# Altium schematic sheet Sheet1.SchDoc
size A3
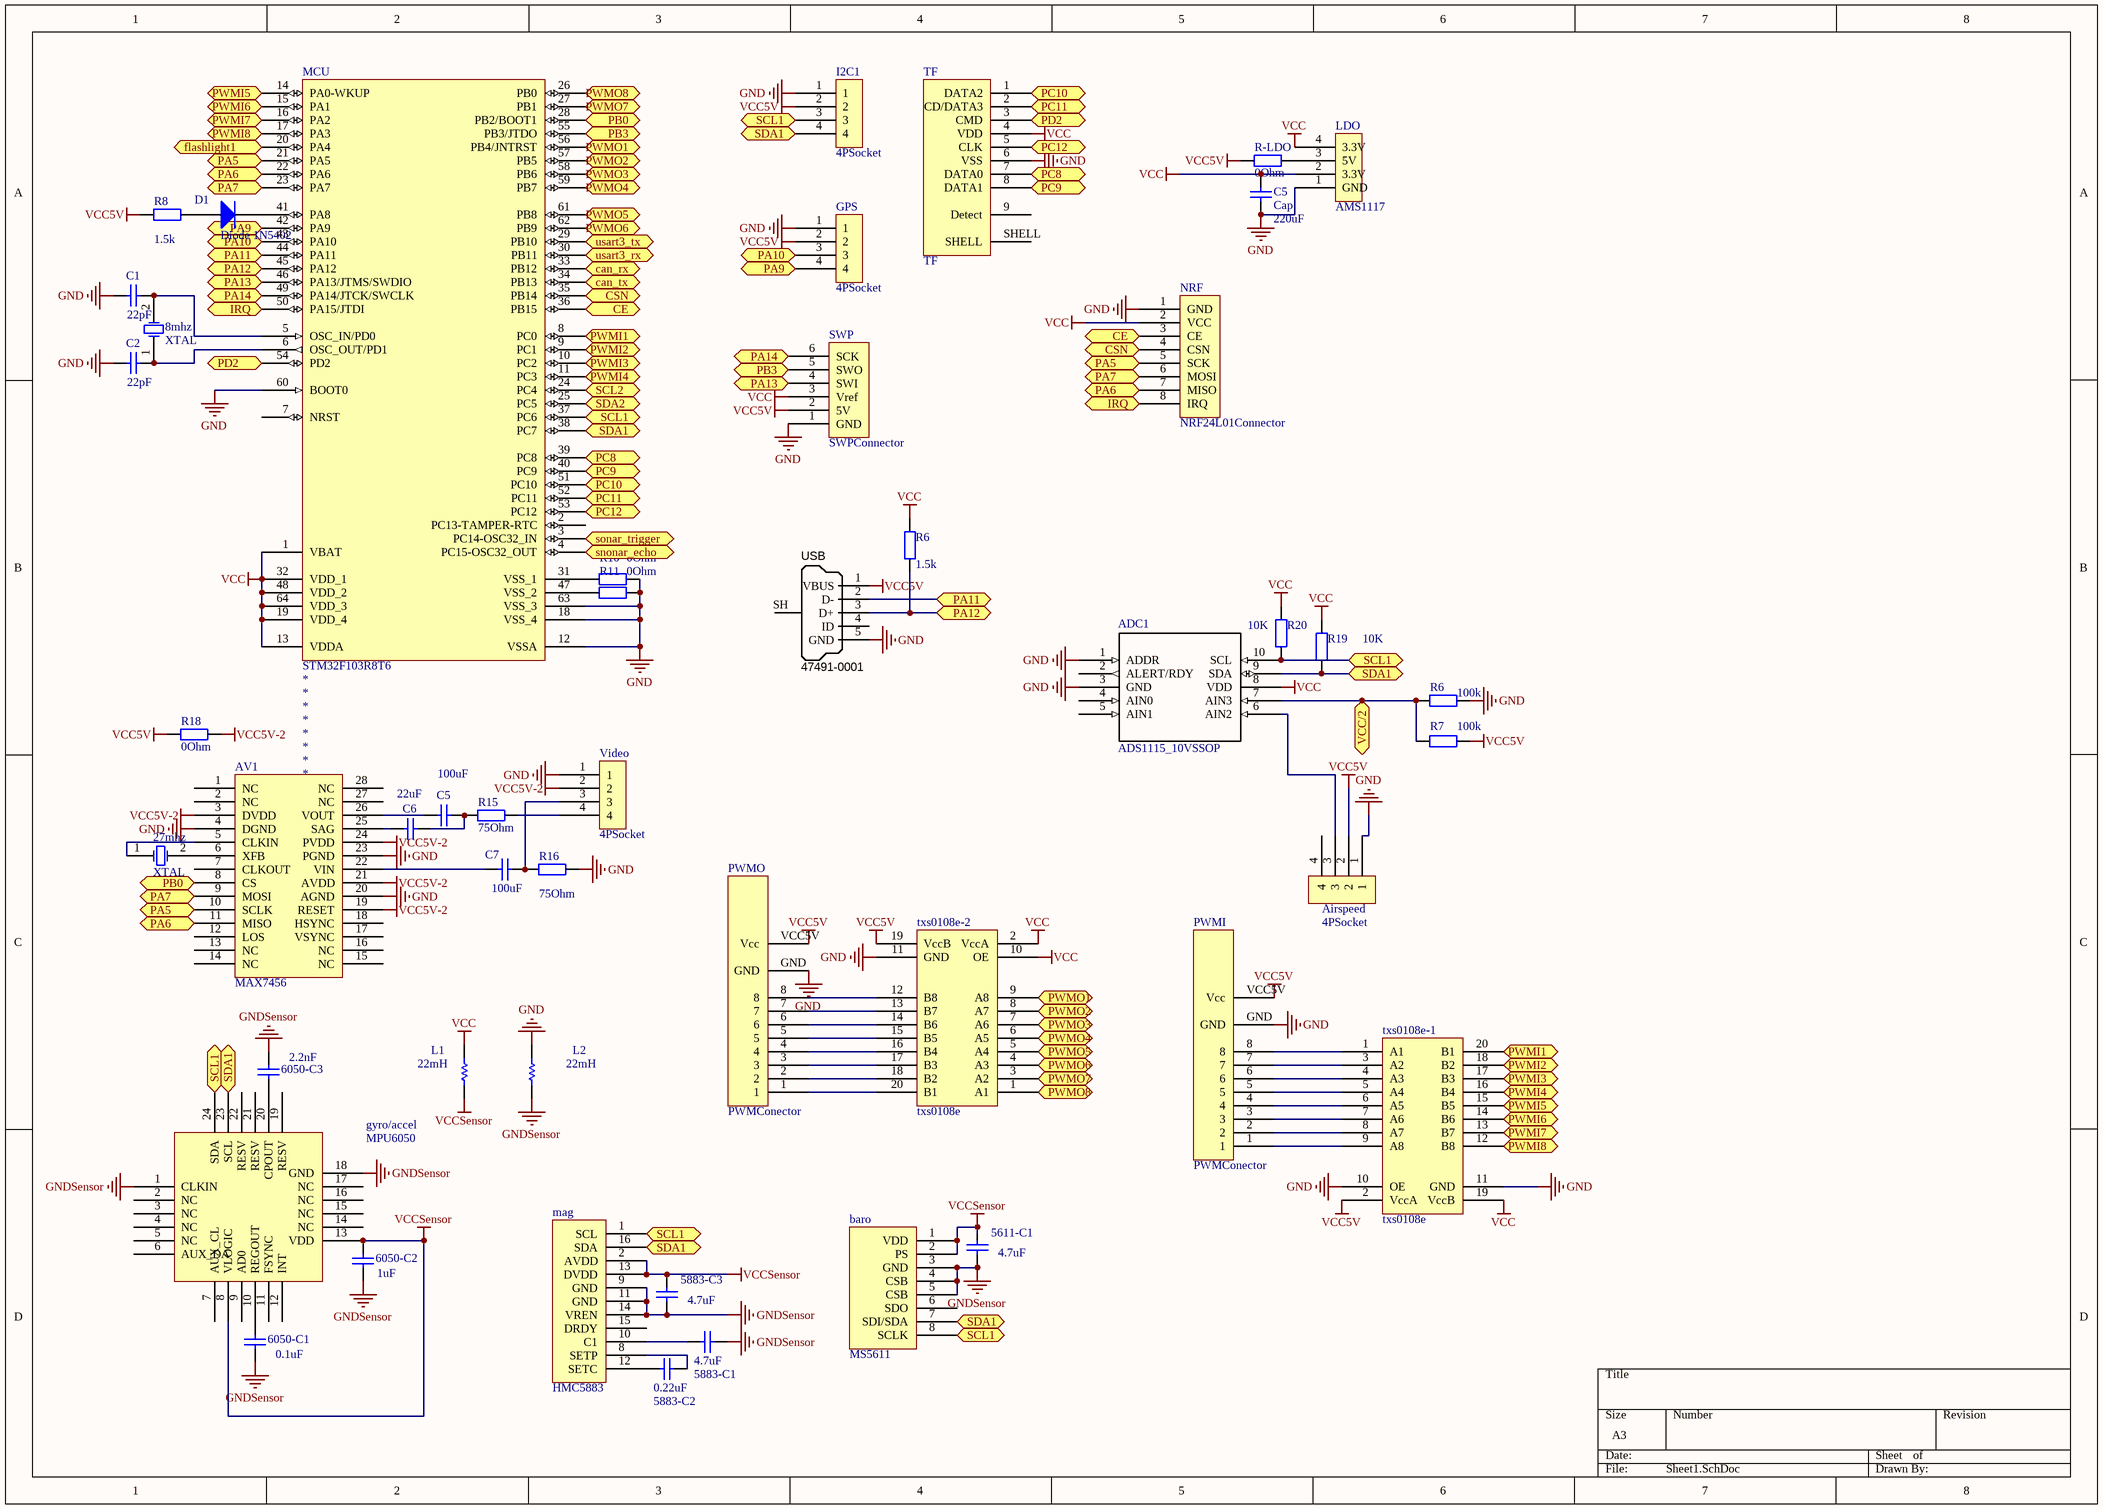
[diagram p0: Sheet1.SchDoc]

## Parts
(Parts that share a designator on the sheet are numbered #1, #2 ... from top to bottom, then left to right.)
8mhz  XTAL  [5032]
27mhz  XTAL  [5032]
5611-C1  value 4.7uF  [0603]
5883-C1  value 4.7uF  [0603]
5883-C2  value 0.22uF  [0603]
5883-C3  value 4.7uF  [0603]
6050-C1  value 0.1uF  [0603]
6050-C2  value 1uF  [0603]
6050-C3  value 2.2nF  [0603]
ADC1  ADS1115_10VSSOP  [10VSSOP]
Airspeed  4PSocket  [4P_SMT]
AV1  MAX7456  [28TSSOP - no pad]
baro  MS5611  [MS5611]
C1  value 22pF  [0603]
C2  value 22pF  [0603]
C5#1  Cap  value 220uF  [1210]
C5#2  value 100uF  [1210]
C6  value 22uF  [1210]
C7  value 100uF  [0603]
D1  Diode 1N5402  [0603]
GPS  4PSocket  [4P_SMT]
gyro/accel  MPU6050  [MPU6050]
I2C1  4PSocket  [4P_SMT]
L1  value 22mH  [0603]
L2  value 22mH  [0603]
LDO  AMS1117  [SOT-223]
mag  HMC5883  [HMC5883]
MCU  STM32F103R8T6  [LQFP64_N]
NRF  NRF24L01Connector  [NRF24L01Pad - SMT]
PWMI  PWMConector  [PWMConnector]
PWMO  PWMConector  [PWMConnector]
R6#1  value 1.5k  [0603]
R6#2  value 100k  [0603]
R7  value 100k  [0603]
R8  value 1.5k  [0603]
R10  value 0Ohm  [0603]
R11  value 0Ohm  [0603]
R15  value 75Ohm  [0603]
R16  value 75Ohm  [0603]
R18  value 0Ohm  [0603]
R19  value 10K  [0603]
R20  value 10K  [0603]
R-LDO  value 0Ohm  [0603]
SWP  SWPConnector  [SWPConnector - SMT]
TF  TF  [TF]
txs0108e-1  txs0108e  [TSSOP20]
txs0108e-2  txs0108e  [TSSOP20]
USB  Manufacturer Part Number 1: 47491-0001  [USB]  (hidden comment: USB Micro Type B)
Video  4PSocket  [4P_SMT]

## Ports
can_rx, can_tx, CE, CSN, flashlight1, IRQ, PA5, PA6, PA7, PA9, PA10, PA11, PA12, PA13, PA14, PB0, PB3, PC8, PC9, PC10, PC11, PC12, PD2, PWMI1, PWMI2, PWMI3, PWMI4, PWMI5, PWMI6, PWMI7, PWMI8, PWMO1, PWMO2, PWMO3, PWMO4, PWMO5, PWMO6, PWMO7, PWMO8, SCL1, SCL2, SDA1, SDA2, snonar_echo, sonar_trigger, usart3_rx, usart3_tx, VCC/2

## Nets
GND: ADC1.1(ADDR) ADC1.3(GND) Airspeed.1 AV1.4(DGND) AV1.20(AGND) AV1.23(PGND) C1.1 C2.1 C5#1.1 GPS.1 I2C1.1 L2.2 LDO.1(GND) MCU.12(VSSA) MCU.18(VSS_4) MCU.60(BOOT0) MCU.63(VSS_3) NRF.1(GND) PWMI.GND PWMO.GND R6#2.1 R10.2 R11.2 R16.1 SWP.1(GND) TF.6(VSS) txs0108e-1.10(OE) txs0108e-1.11(GND) txs0108e-2.11(GND) USB.5(GND) Video.1
GNDSensor: 5611-C1.1 5883-C1.2 5883-C3.1 6050-C1.1 6050-C2.1 6050-C3.2 baro.3(GND) baro.4(CSB) baro.5(CSB) gyro/accel.1(CLKIN) gyro/accel.18(GND) L2.1 mag.9(GND) mag.11(GND) mag.14(VREN)
VCC: ADC1.8(VDD) C5#1.2 L1.2 LDO.2(3.3V) LDO.4(3.3V) MCU.1(VBAT) MCU.13(VDDA) MCU.19(VDD_4) MCU.32(VDD_1) MCU.48(VDD_2) MCU.64(VDD_3) NRF.2(VCC) R6#1.2 R19.1 R20.1 SWP.3(Vref) TF.4(VDD) txs0108e-1.19(VccB) txs0108e-2.2(VccA) txs0108e-2.10(OE)
VCC5V: Airspeed.2 GPS.2 I2C1.2 PWMI.VCC5V(Vcc) PWMO.VCC5V(Vcc) R7.2 R8.1 R18.1 R-LDO.1 SWP.2(5V) txs0108e-1.2(VccA) txs0108e-2.19(VccB) USB.1(VBUS)
VCC5V-2: AV1.3(DVDD) AV1.19(RESET) AV1.21(AVDD) AV1.24(PVDD) R18.2 Video.2
VCCSensor: 5611-C1.2 5883-C3.2 6050-C2.2 baro.1(VDD) baro.2(PS) gyro/accel.8(VLOGIC) gyro/accel.13(VDD) L1.1 mag.2(AVDD) mag.13(DVDD)
can_rx: MCU.33(PB12) ; port can_rx
can_tx: MCU.34(PB13) ; port can_tx
CE: MCU.36(PB15) NRF.3(CE) ; port CE
CSN: MCU.35(PB14) NRF.4(CSN) ; port CSN
flashlight1: MCU.20(PA4) ; port flashlight1
IRQ: MCU.50(PA15/JTDI) NRF.8(IRQ) ; port IRQ
PA5: AV1.10(SCLK) MCU.21(PA5) NRF.5(SCK) ; port PA5
PA6: AV1.11(MISO) MCU.22(PA6) NRF.7(MISO) ; port PA6
PA7: AV1.9(MOSI) MCU.23(PA7) NRF.6(MOSI) ; port PA7
PA9: GPS.4 MCU.42(PA9) ; port PA9
PA10: GPS.3 MCU.43(PA10) ; port PA10
PA11: MCU.44(PA11) USB.2(D-) ; port PA11
PA12: MCU.45(PA12) R6#1.1 USB.3(D+) ; port PA12
PA13: MCU.46(PA13/JTMS/SWDIO) SWP.4(SWI) ; port PA13
PA14: MCU.49(PA14/JTCK/SWCLK) SWP.6(SCK) ; port PA14
PB0: AV1.8(CS) MCU.28(PB2/BOOT1) ; port PB0
PB3: MCU.55(PB3/JTDO) SWP.5(SWO) ; port PB3
PC8: MCU.39(PC8) TF.7(DATA0) ; port PC8
PC9: MCU.40(PC9) TF.8(DATA1) ; port PC9
PC10: MCU.51(PC10) TF.1(DATA2) ; port PC10
PC11: MCU.52(PC11) TF.2(CD/DATA3) ; port PC11
PC12: MCU.53(PC12) TF.5(CLK) ; port PC12
PD2: MCU.54(PD2) TF.3(CMD) ; port PD2
PWMI1: MCU.8(PC0) txs0108e-1.20(B1) ; port PWMI1
PWMI2: MCU.9(PC1) txs0108e-1.18(B2) ; port PWMI2
PWMI3: MCU.10(PC2) txs0108e-1.17(B3) ; port PWMI3
PWMI4: MCU.11(PC3) txs0108e-1.16(B4) ; port PWMI4
PWMI5: MCU.14(PA0-WKUP) txs0108e-1.15(B5) ; port PWMI5
PWMI6: MCU.15(PA1) txs0108e-1.14(B6) ; port PWMI6
PWMI7: MCU.16(PA2) txs0108e-1.13(B7) ; port PWMI7
PWMI8: MCU.17(PA3) txs0108e-1.12(B8) ; port PWMI8
PWMO1: MCU.56(PB4/JNTRST) txs0108e-2.9(A8) ; port PWMO1
PWMO2: MCU.57(PB5) txs0108e-2.8(A7) ; port PWMO2
PWMO3: MCU.58(PB6) txs0108e-2.7(A6) ; port PWMO3
PWMO4: MCU.59(PB7) txs0108e-2.6(A5) ; port PWMO4
PWMO5: MCU.61(PB8) txs0108e-2.5(A4) ; port PWMO5
PWMO6: MCU.62(PB9) txs0108e-2.4(A3) ; port PWMO6
PWMO7: MCU.27(PB1) txs0108e-2.3(A2) ; port PWMO7
PWMO8: MCU.26(PB0) txs0108e-2.1(A1) ; port PWMO8
SCL1: ADC1.10(SCL) baro.8(SCLK) gyro/accel.24(SDA) I2C1.3 mag.1(SCL) MCU.37(PC6) R20.2 ; port SCL1
SCL2: MCU.24(PC4) ; port SCL2
SDA1: ADC1.9(SDA) baro.7(SDI/SDA) gyro/accel.23(SCL) I2C1.4 mag.16(SDA) MCU.38(PC7) R19.2 ; port SDA1
SDA2: MCU.25(PC5) ; port SDA2
snonar_echo: MCU.4(PC15-OSC32_OUT) ; port snonar_echo
sonar_trigger: MCU.3(PC14-OSC32_IN) ; port sonar_trigger
usart3_rx: MCU.30(PB11) ; port usart3_rx
usart3_tx: MCU.29(PB10) ; port usart3_tx
VCC/2: ADC1.7(AIN3) R6#2.2 R7.1 ; port VCC/2
Net8mhz_1: 8mhz.1(OSC1) C2.2 MCU.6(OSC_OUT/PD1)
Net8mhz_2: 8mhz.2(OSC2) C1.2 MCU.5(OSC_IN/PD0)
Net27mhz_1: 27mhz.1(OSC1) AV1.5(CLKIN)
Net27mhz_2: 27mhz.2(OSC2) AV1.6(XFB)
Net5883-C1_1: 5883-C1.1 mag.10(C1)
Net5883-C2_1: 5883-C2.1 mag.12(SETC)
Net5883-C2_2: 5883-C2.2 mag.8(SETP)
Net6050-C1_2: 6050-C1.2 gyro/accel.10(REGOUT)
Net6050-C3_1: 6050-C3.1 gyro/accel.20(CPOUT)
NetADC1_6: ADC1.6(AIN2) Airspeed.3
NetAV1_22: AV1.22(VIN) C7.1
NetAV1_25: AV1.25(SAG) C6.1
NetAV1_26: AV1.26(VOUT) C5#2.1
NetC5#2_2: C5#2.2 C6.2 R15.1
NetC7_2: C7.2 R16.2 Video.3
NetD1_1: D1.1(A) R8.2
NetD1_2: D1.2(K) MCU.41(PA8)
NetLDO_3: LDO.3(5V) R-LDO.2
NetMCU_31: MCU.31(VSS_1) R10.1
NetMCU_47: MCU.47(VSS_2) R11.1
NetPWMI_1: PWMI.1 txs0108e-1.9(A8)
NetPWMI_2: PWMI.2 txs0108e-1.8(A7)
NetPWMI_3: PWMI.3 txs0108e-1.7(A6)
NetPWMI_4: PWMI.4 txs0108e-1.6(A5)
NetPWMI_5: PWMI.5 txs0108e-1.5(A4)
NetPWMI_6: PWMI.6 txs0108e-1.4(A3)
NetPWMI_7: PWMI.7 txs0108e-1.3(A2)
NetPWMI_8: PWMI.8 txs0108e-1.1(A1)
NetPWMO_1: PWMO.1 txs0108e-2.20(B1)
NetPWMO_2: PWMO.2 txs0108e-2.18(B2)
NetPWMO_3: PWMO.3 txs0108e-2.17(B3)
NetPWMO_4: PWMO.4 txs0108e-2.16(B4)
NetPWMO_5: PWMO.5 txs0108e-2.15(B5)
NetPWMO_6: PWMO.6 txs0108e-2.14(B6)
NetPWMO_7: PWMO.7 txs0108e-2.13(B7)
NetPWMO_8: PWMO.8 txs0108e-2.12(B8)
NetR15_2: R15.2 Video.4

Not connected (* = marked no-connect by the designer): ADC1 2(ALERT/RDY) 4(AIN0) 5(AIN1); Airspeed 4; AV1 1(NC) 2(NC) 7(CLKOUT) 12(LOS) 13(NC) 14(NC) 15(NC) 16(NC) 17(VSYNC) 18(HSYNC) 27(NC) 28(NC); baro 6(SDO); gyro/accel 2(NC) 3(NC) 4(NC) 5(NC) 6(AUX_DA) 7(AUX_CL) 9(AD0) 11(FSYNC) 12(INT) 14(NC) 15(NC) 16(NC) 17(NC) 19(RESV) 21(RESV) 22(RESV); mag 15(DRDY); MCU 2(PC13-TAMPER-RTC) 7(NRST); TF 9(Detect) SHELL; USB 4(ID) SH(Shell)

## Library data of the parts
8mhz 27mhz = XTAL: Crystal Oscillator; Published: 8-Jun-2000; LatestRevisionDate: 17-Jul-2002; LatestRevisionNote: Re-released for DXP Platform.; PackageReference: R38; Publisher: Altium Limited; PackageDescription: Crystal, Thru-Hole; 2 Leads; Body 3.1 x 8.2 mm (Dia.xH)
5611-C1 5883-C1-5883-C3 6050-C1-6050-C3 C5#2 C6 C7 = Cap Semi: Capacitor (Semiconductor SIM Model); Published: 8-Jun-2000; LatestRevisionDate: 29-May-2009; LatestRevisionNote: IPC-7351 Footprint Added.; PackageReference: C1206; Publisher: Altium Limited; PackageDescription: Chip Capacitor
ADC1 = ADS1115_10VSSOP: Manufacturer: Texas Instruments; INDUSTRY_STD_PKG_TYPE: MSOP; FAMILY_NAME: PRECISION ADC (<=10MSPS); PIN_COUNT: 10; PACKAGE_DESIGNATOR: DGS; Datasheet URL: http://www.ti.com/lit/gpn/ADS1115; GENERIC_PART_NUMBER: ADS1115; RefDes: RefDes; Type: DEV; Value: Value
C1 C2 C5#1 = Cap: Capacitor; Published: 8-Jun-2000; LatestRevisionDate: 17-Jul-2002; LatestRevisionNote: Re-released for DXP Platform.; PackageReference: RAD-0.3; Publisher: Altium Limited; PackageDescription: Radial Cap, Thru-Hole; 2 Leads; 0.3 in Pin Spacing
D1 = Diode 1N5402: 3 Amp General Purpose Rectifier; Published: 8-Jun-2000; LatestRevisionDate: 17-Jul-2002; LatestRevisionNote: Re-released for DXP Platform.; DatasheetVersion: 1998; PackageVersion: Aug-1999; PackageReference: DO-201AD; Publisher: Altium Limited; PackageDescription: Diode, Axial; Body 9.5 x 5.6 mm (LxDia. max), Lead Dia. 1.32 mm (max); ComponentLink1Description: Manufacturer Link; ComponentLink1URL: http://www.fairchildsemi.com/; ComponentLink2Description: Datasheet; ComponentLink2URL: http://www.fairchildsemi.com/ds/1N%2F1N5400.pdf
L1 L2 = Res1: Resistor; Published: 8-Jun-2000; LatestRevisionDate: 17-Jul-2002; LatestRevisionNote: Re-released for DXP Platform.; PackageReference: AXIAL-0.3; Publisher: Altium Limited; PackageDescription: Axial Device, Thru-Hole; 2 Leads; 0.3 in Pin Spacing
MCU = STM32F103R8T6: STM32 ARM-based 32-bit MCU with 64 Kbytes Flash, 64-pin LQFP, Industrial Temperature; Published: *; DatasheetVersion: *; PackageVersion: *; PackageReference: *; Publisher: *; PackageDescription: *; ComponentLink1Description: *; ComponentLink1URL: *; ComponentLink2Description: *; ComponentLink2URL: *
R6#1 R6#2 R7 R8 R10 R11 R15 R16 R18-R20 R-LDO = Res2: Resistor; Published: 8-Jun-2000; LatestRevisionDate: 17-Jul-2002; LatestRevisionNote: Re-released for DXP Platform.; PackageReference: AXIAL-0.4; Publisher: Altium Limited; PackageDescription: Axial Device, Thru-Hole; 2 Leads; 0.4 in Pin Spacing
USB = USB_Micro_TypeB: Connector SMD USB Micro Type B middle mount; Manufacturer 1: Molex Inc; SCDType: undef; Package / Case: SMD; Supplier 1: Digi-Key; Supplier Part Number 1: WM17142CT-ND